# Altium schematic sheet OSSI-1 OBC_1.SchDoc: TITLE:
size 410 x 286 mm; Date: Date:; >LAST_DATE_TIME: 01/11/2015 13:38:41; Sheet:: Sheet:; >SHEET: 2; REV:: REV:; Document Number:: Document Number:; >DRAWING_NAME: OSSI-1 OBC.sch
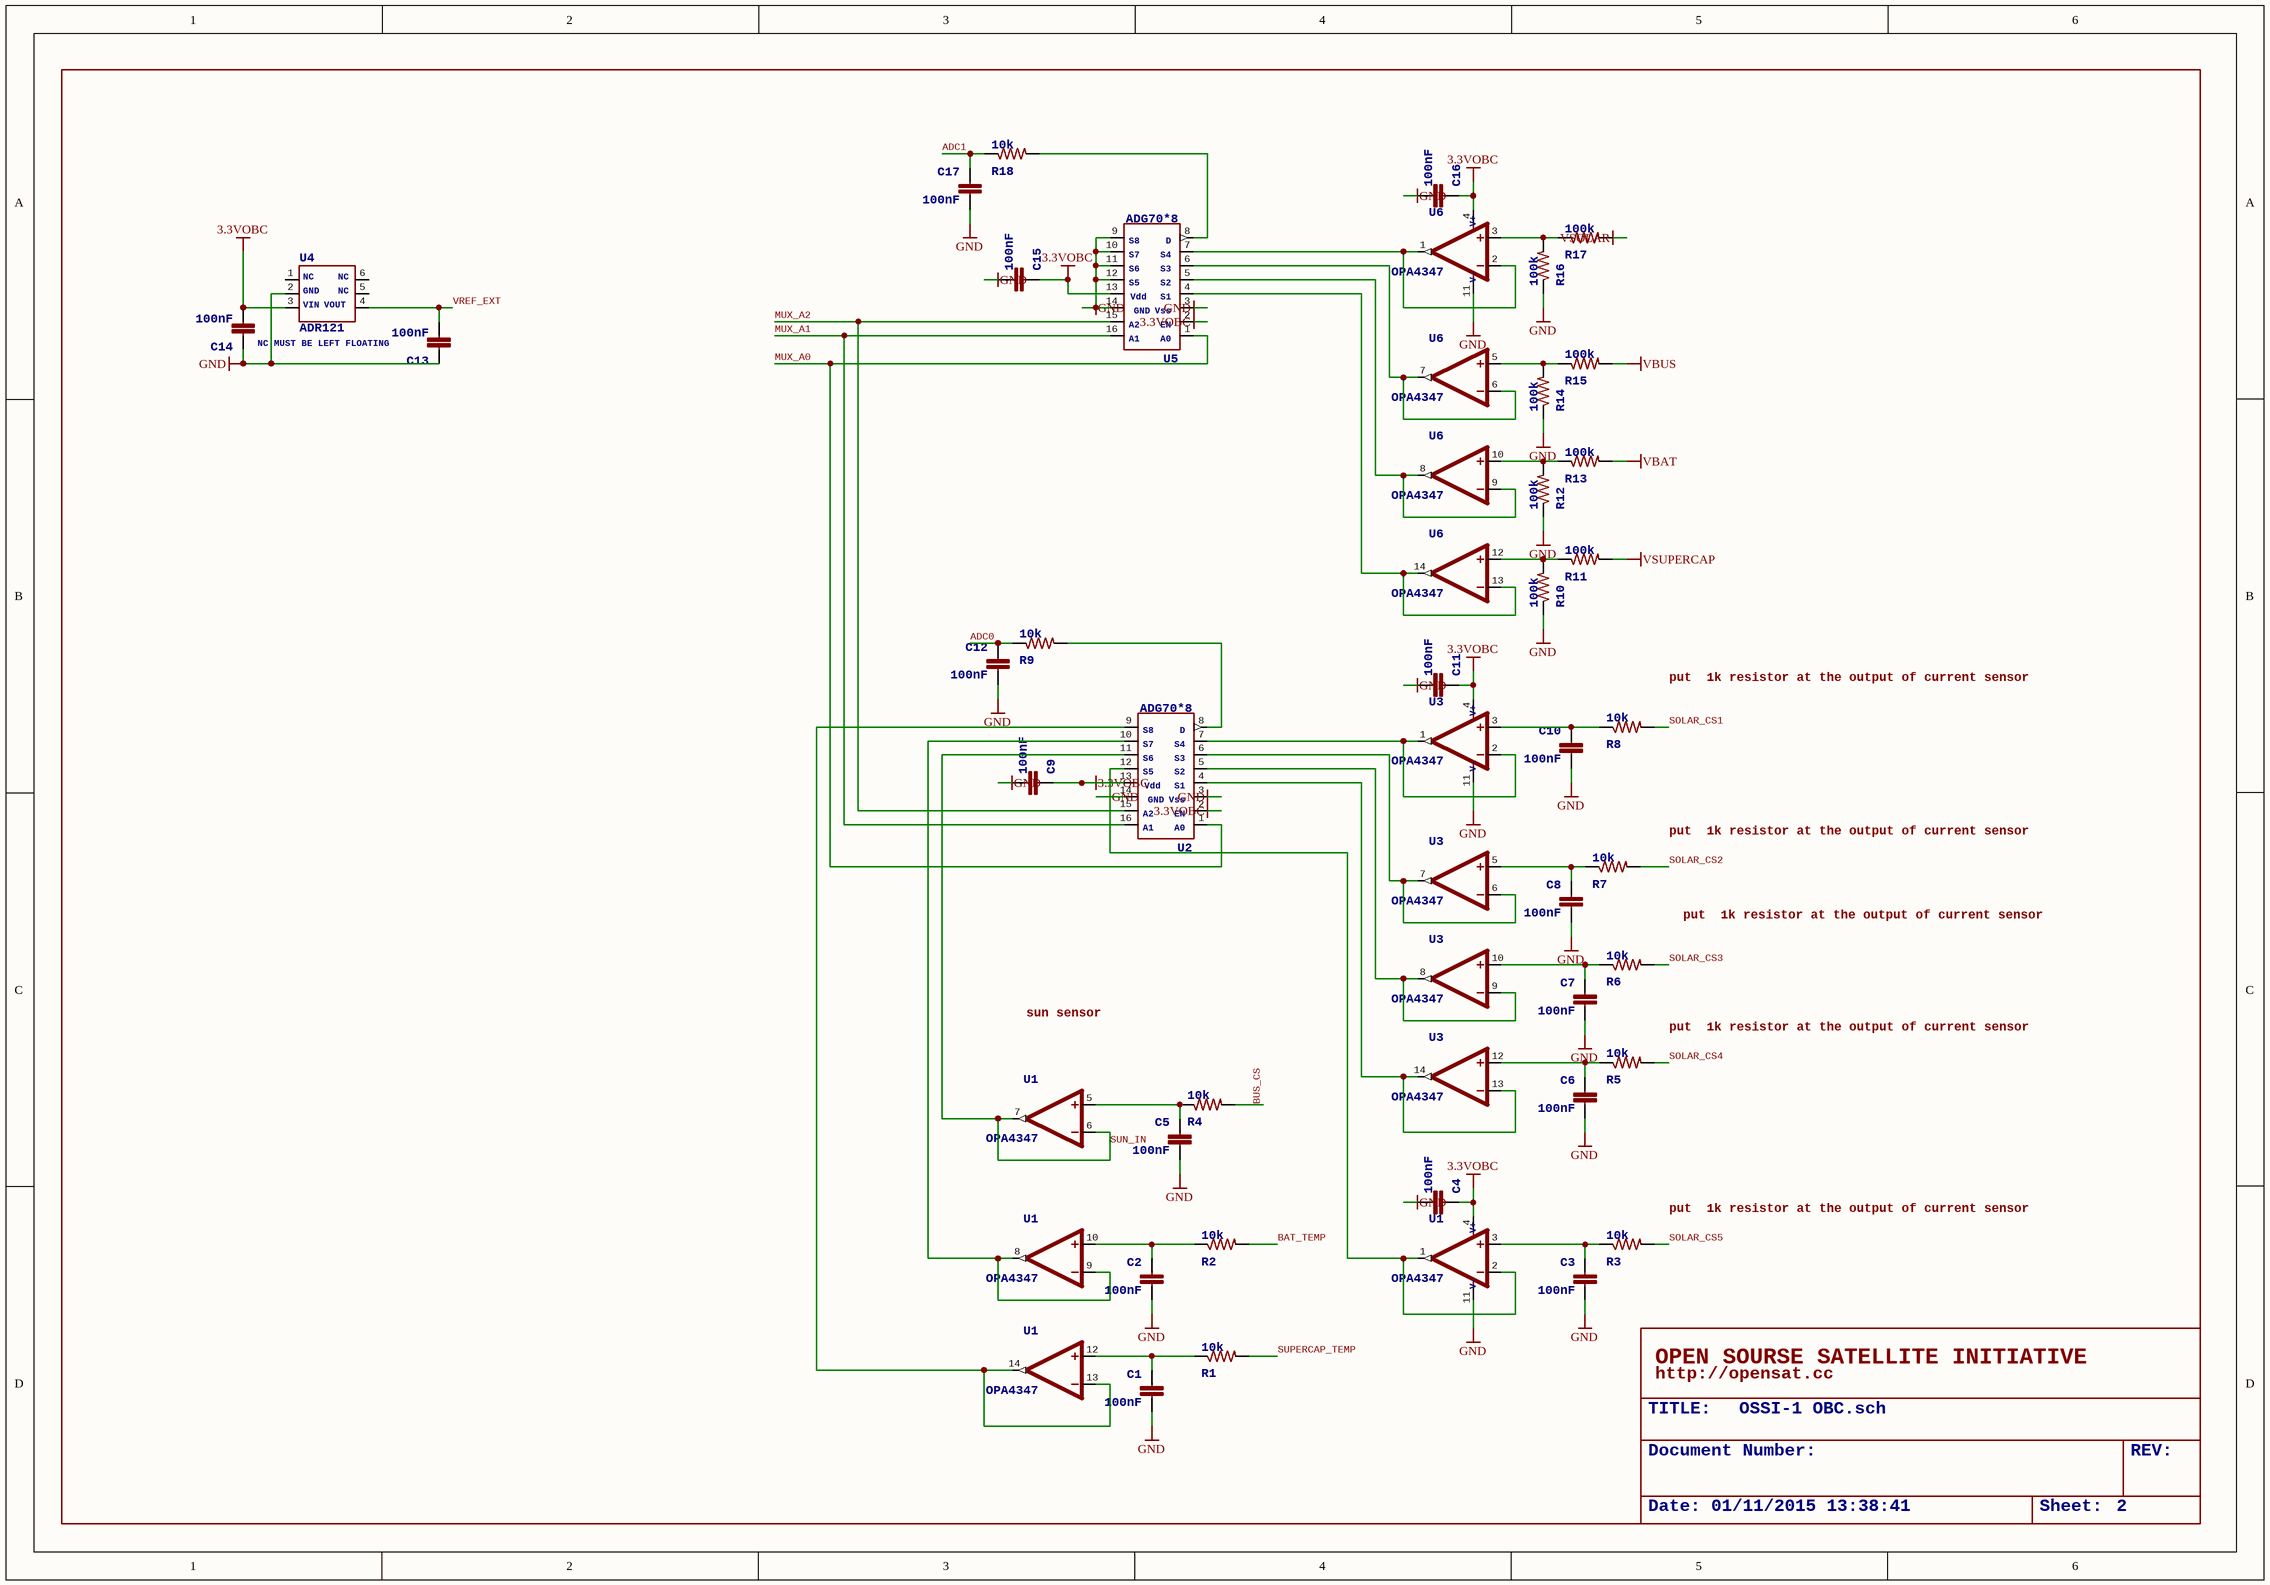
[diagram p0: OSSI-1 OBC_1.SchDoc]

## Parts
C1  >NAME: C1  [C0603(1608)]  (hidden comment: 100nF)
C2  >NAME: C2  [C0603(1608)]  (hidden comment: 100nF)
C3  >NAME: C3  [C0603(1608)]  (hidden comment: 100nF)
C4  >NAME: C4  [C0603(1608)]  (hidden comment: 100nF)
C5  >NAME: C5  [C0603(1608)]  (hidden comment: 100nF)
C6  >NAME: C6  [C0603(1608)]  (hidden comment: 100nF)
C7  >NAME: C7  [C0603(1608)]  (hidden comment: 100nF)
C8  >NAME: C8  [C0603(1608)]  (hidden comment: 100nF)
C9  >NAME: C9  [C0603(1608)]  (hidden comment: 100nF)
C10  >NAME: C10  [C0603(1608)]  (hidden comment: 100nF)
C11  >NAME: C11  [C0603(1608)]  (hidden comment: 100nF)
C12  >NAME: C12  [C0603(1608)]  (hidden comment: 100nF)
C13  >NAME: C13  [C0603(1608)]  (hidden comment: 100nF)
C14  >NAME: C14  [C0603(1608)]  (hidden comment: 100nF)
C15  >NAME: C15  [C0603(1608)]  (hidden comment: 100nF)
C16  >NAME: C16  [C0603(1608)]  (hidden comment: 100nF)
C17  >NAME: C17  [C0603(1608)]  (hidden comment: 100nF)
R1  >NAME: R1  [R0603(1608)]  (hidden comment: 10k)
R2  >NAME: R2  [R0603(1608)]  (hidden comment: 10k)
R3  >NAME: R3  [R0603(1608)]  (hidden comment: 10k)
R4  >NAME: R4  [R0603(1608)]  (hidden comment: 10k)
R5  >NAME: R5  [R0603(1608)]  (hidden comment: 10k)
R6  >NAME: R6  [R0603(1608)]  (hidden comment: 10k)
R7  >NAME: R7  [R0603(1608)]  (hidden comment: 10k)
R8  >NAME: R8  [R0603(1608)]  (hidden comment: 10k)
R9  >NAME: R9  [R0603(1608)]  (hidden comment: 10k)
R10  >NAME: R10  [R0603(1608)]  (hidden comment: 100k)
R11  >NAME: R11  [R0603(1608)]  (hidden comment: 100k)
R12  >NAME: R12  [R0603(1608)]  (hidden comment: 100k)
R13  >NAME: R13  [R0603(1608)]  (hidden comment: 100k)
R14  >NAME: R14  [R0603(1608)]  (hidden comment: 100k)
R15  >NAME: R15  [R0603(1608)]  (hidden comment: 100k)
R16  >NAME: R16  [R0603(1608)]  (hidden comment: 100k)
R17  >NAME: R17  [R0603(1608)]  (hidden comment: 100k)
R18  >NAME: R18  [R0603(1608)]  (hidden comment: 10k)
U1  >NAME: U1  [TSSOP14-PW]  (hidden comment: OPA4347)  (parts A,B,C,D of 4)
U2  >NAME: U2  [TSSOP16-RU]  (hidden comment: ADG70*8)
U3  >NAME: U3  [TSSOP14-PW]  (hidden comment: OPA4347)  (parts A,B,C,D of 4)
U4  >NAME: U4  [TSOT-6UJ-6]  (hidden comment: ADR121)
U5  >NAME: U5  [TSSOP16-RU]  (hidden comment: ADG70*8)
U6  >NAME: U6  [TSSOP14-PW]  (hidden comment: OPA4347)  (parts A,B,C,D of 4)

## Nets
3.3VOBC: C4.1 C9.1 C11.1 C14.2 C15.1 C16.1 U1.4(V+) U2.2(P$2) U2.13(P$13) U3.4(V+) U4.3(P$3) U5.2(P$2) U5.13(P$13) U6.4(V+)
GND: C1.2 C2.2 C3.2 C4.2 C5.2 C6.2 C7.2 C8.2 C9.2 C10.2 C11.2 C12.2 C13.1 C14.1 C15.2 C16.2 C17.2 R10.1 R12.1 R14.1 R16.1 U1.11(V-) U2.3(P$3) U2.14(P$14) U3.11(V-) U4.2(P$2) U5.3(P$3) U5.9(P$9) U5.10(P$10) U5.11(P$11) U5.12(P$12) U5.14(P$14) U6.11(V-)
VBAT: R13.2
VBUS: R15.2
VSOLAR: R17.2
VSUPERCAP: R11.2
ADC0: C12.1 R9.1
ADC1: C17.1 R18.1
BAT_TEMP: R2.2
BUS_CS: R4.2
MUX_A0: U2.1(P$1) U5.1(P$1)
MUX_A1: U2.16(P$16) U5.16(P$16)
MUX_A2: U2.15(P$15) U5.15(P$15)
SOLAR_CS1: R8.2
SOLAR_CS2: R7.2
SOLAR_CS3: R6.2
SOLAR_CS4: R5.2
SOLAR_CS5: R3.2
SUN_IN: U1.6(-IN) U1.7(OUT) U2.11(P$11)
SUPERCAP_TEMP: R1.2
VREF_EXT: C13.2 U4.4(P$4)
NetC1_1: C1.1 R1.1 U1.12(+IN)
NetC2_1: C2.1 R2.1 U1.10(+IN)
NetC3_1: C3.1 R3.1 U1.3(+IN)
NetC5_1: C5.1 R4.1 U1.5(+IN)
NetC6_1: C6.1 R5.1 U3.12(+IN)
NetC7_1: C7.1 R6.1 U3.10(+IN)
NetC8_1: C8.1 R7.1 U3.5(+IN)
NetC10_1: C10.1 R8.1 U3.3(+IN)
NetR9_2: R9.2 U2.8(P$8)
NetR10_2: R10.2 R11.1 U6.12(+IN)
NetR12_2: R12.2 R13.1 U6.10(+IN)
NetR14_2: R14.2 R15.1 U6.5(+IN)
NetR16_2: R16.2 R17.1 U6.3(+IN)
NetR18_2: R18.2 U5.8(P$8)
NetU1_1: U1.1(OUT) U1.2(-IN) U2.12(P$12)
NetU1_8: U1.8(OUT) U1.9(-IN) U2.10(P$10)
NetU1_13: U1.13(-IN) U1.14(OUT) U2.9(P$9)
NetU2_4: U2.4(P$4) U3.13(-IN) U3.14(OUT)
NetU2_5: U2.5(P$5) U3.8(OUT) U3.9(-IN)
NetU2_6: U2.6(P$6) U3.6(-IN) U3.7(OUT)
NetU2_7: U2.7(P$7) U3.1(OUT) U3.2(-IN)
NetU5_4: U5.4(P$4) U6.13(-IN) U6.14(OUT)
NetU5_5: U5.5(P$5) U6.8(OUT) U6.9(-IN)
NetU5_6: U5.6(P$6) U6.6(-IN) U6.7(OUT)
NetU5_7: U5.7(P$7) U6.1(OUT) U6.2(-IN)

Not connected (* = marked no-connect by the designer): U4 1(P$1) 5(P$5) 6(P$6)

## Notes on the sheet
- (near R8) put  1k resistor at the output of current sensor
- (near R7) put  1k resistor at the output of current sensor
- put  1k resistor at the output of current sensor
- sun sensor
- (near R3) put  1k resistor at the output of current sensor
- OPEN SOURSE SATELLITE INITIATIVE
- http://opensat.cc

## Library data of the parts
C1-C17 = C0603(1608): >VALUE: 100nF
R1-R18 = R0603(1608)
  R1-R9 R18: >VALUE: 10k
  R10-R17: >VALUE: 100k
U1 U3 U6 = OPA4347: <b>OPA4347</b> / <ul> / <li>RAIL-TO-RAIL INPUT AND OUTPUT</li> / <li>SINGLE SUPPLY: 2.3V to 5.5V</li> / <li>LOW IQ: 20µ</li> / </ul>; >VALUE: OPA4347; V+: V+; V-: V-
U4 = ADR127BUJZ-REEL7: ADR127<br/> / Precision, Micropower LDO Voltage / References in TSOT / <br/>ADR127BUJZ-REEL7; >VALUE: ADR121; NC: NC; GND: GND; VIN: VIN; VOUT: VOUT; NC MUST BE LEFT FLOATING: NC MUST BE LEFT FLOATING
U2 U5 = ADG70*8: A0: A0; EN: EN; Vss: Vss; S1: S1; S2: S2; S3: S3; S4: S4; D: D; S5: S5; S6: S6; S7: S7; S8: S8; Vdd: Vdd; GND: GND; A2: A2; A1: A1; >VALUE: ADG70*8